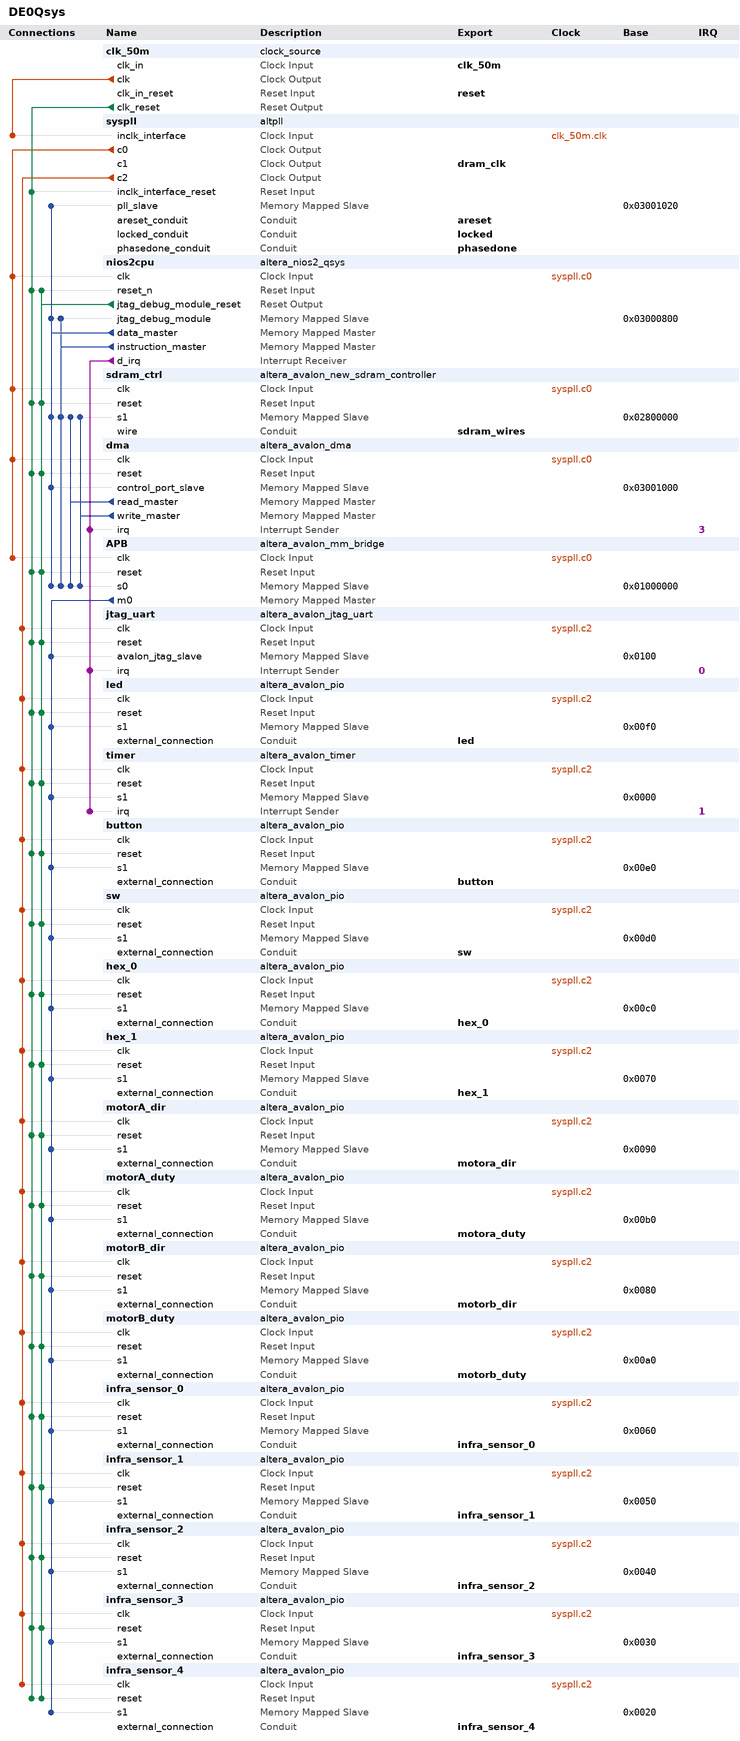
[diagram p0: system contents]
# Platform Designer (Qsys) system DE0Qsys, Cyclone III EP3C16F484C6
# Parameters at their usual value, and those the tool derives, are not listed.
package require -exact qsys 13.0.1.99.2
create_system DE0Qsys
set_project_property DEVICE_FAMILY {Cyclone III}
set_project_property DEVICE EP3C16F484C6

add_instance clk_50m clock_source 13.0
set_instance_parameter_value clk_50m clockFrequency 50000000

add_instance syspll altpll 13.0
set_instance_parameter_value syspll INCLK0_INPUT_FREQUENCY 20000
set_instance_parameter_value syspll CLK0_MULTIPLY_BY 8
set_instance_parameter_value syspll CLK1_MULTIPLY_BY 8
set_instance_parameter_value syspll CLK2_MULTIPLY_BY 1
set_instance_parameter_value syspll CLK0_DIVIDE_BY 3
set_instance_parameter_value syspll CLK1_DIVIDE_BY 3
set_instance_parameter_value syspll CLK2_DIVIDE_BY 5
set_instance_parameter_value syspll CLK1_PHASE_SHIFT -1875
set_instance_parameter_value syspll CLK2_PHASE_SHIFT 0
set_instance_parameter_value syspll CLK1_DUTY_CYCLE 50
set_instance_parameter_value syspll CLK2_DUTY_CYCLE 50
set_instance_parameter_value syspll PORT_clk1 PORT_USED
set_instance_parameter_value syspll PORT_clk2 PORT_USED
set_instance_parameter_value syspll PORT_clk3 PORT_UNUSED
set_instance_parameter_value syspll PORT_ARESET PORT_UNUSED
set_instance_parameter_value syspll PORT_LOCKED PORT_UNUSED

add_instance nios2cpu altera_nios2_qsys 13.0
set_instance_parameter_value nios2cpu resetSlave sdram_ctrl.s1
set_instance_parameter_value nios2cpu mmu_TLBMissExcSlave None
set_instance_parameter_value nios2cpu exceptionSlave sdram_ctrl.s1
set_instance_parameter_value nios2cpu breakSlave nios2cpu.jtag_debug_module
set_instance_parameter_value nios2cpu impl Tiny
set_instance_parameter_value nios2cpu icache_size 4096

add_instance sdram_ctrl altera_avalon_new_sdram_controller 13.0.1.99.2
set_instance_parameter_value sdram_ctrl TAC 5.5
set_instance_parameter_value sdram_ctrl TRCD 20.0
set_instance_parameter_value sdram_ctrl TRP 20.0
set_instance_parameter_value sdram_ctrl casLatency 3
set_instance_parameter_value sdram_ctrl columnWidth 8
set_instance_parameter_value sdram_ctrl dataWidth 16
set_instance_parameter_value sdram_ctrl generateSimulationModel false
set_instance_parameter_value sdram_ctrl model single_Micron_MT48LC4M32B2_7_chip
set_instance_parameter_value sdram_ctrl numberOfBanks 4
set_instance_parameter_value sdram_ctrl numberOfChipSelects 1
set_instance_parameter_value sdram_ctrl powerUpDelay 200.0
set_instance_parameter_value sdram_ctrl refreshPeriod 7.8125
set_instance_parameter_value sdram_ctrl rowWidth 12

add_instance dma altera_avalon_dma 13.0.1.99.2
set_instance_parameter_value dma allowByteTransactions true
set_instance_parameter_value dma allowDoubleWordTransactions true
set_instance_parameter_value dma allowHalfWordTransactions true
set_instance_parameter_value dma allowQuadWordTransactions true
set_instance_parameter_value dma burstEnable true
set_instance_parameter_value dma fifoDepth 32
set_instance_parameter_value dma maxBurstSize 128
set_instance_parameter_value dma minimumDmaTransactionRegisterWidth 13

add_instance APB altera_avalon_mm_bridge 13.0
set_instance_parameter_value APB DATA_WIDTH 32
set_instance_parameter_value APB ADDRESS_WIDTH 10
set_instance_parameter_value APB ADDRESS_UNITS SYMBOLS
set_instance_parameter_value APB MAX_PENDING_RESPONSES 4

add_instance jtag_uart altera_avalon_jtag_uart 13.0.1.99.2
set_instance_parameter_value jtag_uart simInteractiveOptions NO_INTERACTIVE_WINDOWS

add_instance led altera_avalon_pio 13.0.1.99.2
set_instance_parameter_value led direction Output
set_instance_parameter_value led width 10

add_instance timer altera_avalon_timer 13.0.1.99.2
set_instance_parameter_value timer period 1
set_instance_parameter_value timer periodUnits USEC

add_instance button altera_avalon_pio 13.0.1.99.2
set_instance_parameter_value button captureEdge true
set_instance_parameter_value button direction Input
set_instance_parameter_value button edgeType FALLING
set_instance_parameter_value button simDoTestBenchWiring true
set_instance_parameter_value button width 2

add_instance sw altera_avalon_pio 13.0.1.99.2
set_instance_parameter_value sw captureEdge true
set_instance_parameter_value sw direction Input
set_instance_parameter_value sw edgeType ANY
set_instance_parameter_value sw simDoTestBenchWiring true
set_instance_parameter_value sw width 10

add_instance hex_0 altera_avalon_pio 13.0.1.99.2
set_instance_parameter_value hex_0 direction Output
set_instance_parameter_value hex_0 width 8

add_instance hex_1 altera_avalon_pio 13.0.1.99.2
set_instance_parameter_value hex_1 direction Output
set_instance_parameter_value hex_1 width 8

add_instance motorA_dir altera_avalon_pio 13.0.1.99.2
set_instance_parameter_value motorA_dir direction Output
set_instance_parameter_value motorA_dir width 2

add_instance motorA_duty altera_avalon_pio 13.0.1.99.2
set_instance_parameter_value motorA_duty direction Output
set_instance_parameter_value motorA_duty width 8

add_instance motorB_dir altera_avalon_pio 13.0.1.99.2
set_instance_parameter_value motorB_dir direction Output
set_instance_parameter_value motorB_dir width 2

add_instance motorB_duty altera_avalon_pio 13.0.1.99.2
set_instance_parameter_value motorB_duty direction Output
set_instance_parameter_value motorB_duty width 8

add_instance infra_sensor_0 altera_avalon_pio 13.0.1.99.2
set_instance_parameter_value infra_sensor_0 direction Input
set_instance_parameter_value infra_sensor_0 simDoTestBenchWiring true
set_instance_parameter_value infra_sensor_0 width 1

add_instance infra_sensor_1 altera_avalon_pio 13.0.1.99.2
set_instance_parameter_value infra_sensor_1 direction Input
set_instance_parameter_value infra_sensor_1 simDoTestBenchWiring true
set_instance_parameter_value infra_sensor_1 width 1

add_instance infra_sensor_2 altera_avalon_pio 13.0.1.99.2
set_instance_parameter_value infra_sensor_2 direction Input
set_instance_parameter_value infra_sensor_2 simDoTestBenchWiring true
set_instance_parameter_value infra_sensor_2 width 1

add_instance infra_sensor_3 altera_avalon_pio 13.0.1.99.2
set_instance_parameter_value infra_sensor_3 direction Input
set_instance_parameter_value infra_sensor_3 simDoTestBenchWiring true
set_instance_parameter_value infra_sensor_3 width 1

add_instance infra_sensor_4 altera_avalon_pio 13.0.1.99.2
set_instance_parameter_value infra_sensor_4 direction Input
set_instance_parameter_value infra_sensor_4 simDoTestBenchWiring true
set_instance_parameter_value infra_sensor_4 width 1

# connections
add_connection clk_50m.clk syspll.inclk_interface clock
add_connection syspll.c0 APB.clk clock
add_connection syspll.c0 dma.clk clock
add_connection syspll.c0 nios2cpu.clk clock
add_connection syspll.c0 sdram_ctrl.clk clock
add_connection syspll.c2 button.clk clock
add_connection syspll.c2 hex_0.clk clock
add_connection syspll.c2 hex_1.clk clock
add_connection syspll.c2 infra_sensor_0.clk clock
add_connection syspll.c2 infra_sensor_1.clk clock
add_connection syspll.c2 infra_sensor_2.clk clock
add_connection syspll.c2 infra_sensor_3.clk clock
add_connection syspll.c2 infra_sensor_4.clk clock
add_connection syspll.c2 jtag_uart.clk clock
add_connection syspll.c2 led.clk clock
add_connection syspll.c2 motorA_dir.clk clock
add_connection syspll.c2 motorA_duty.clk clock
add_connection syspll.c2 motorB_dir.clk clock
add_connection syspll.c2 motorB_duty.clk clock
add_connection syspll.c2 sw.clk clock
add_connection syspll.c2 timer.clk clock
add_connection clk_50m.clk_reset APB.reset reset
add_connection clk_50m.clk_reset button.reset reset
add_connection clk_50m.clk_reset dma.reset reset
add_connection clk_50m.clk_reset hex_0.reset reset
add_connection clk_50m.clk_reset hex_1.reset reset
add_connection clk_50m.clk_reset infra_sensor_0.reset reset
add_connection clk_50m.clk_reset infra_sensor_1.reset reset
add_connection clk_50m.clk_reset infra_sensor_2.reset reset
add_connection clk_50m.clk_reset infra_sensor_3.reset reset
add_connection clk_50m.clk_reset infra_sensor_4.reset reset
add_connection clk_50m.clk_reset jtag_uart.reset reset
add_connection clk_50m.clk_reset led.reset reset
add_connection clk_50m.clk_reset motorA_dir.reset reset
add_connection clk_50m.clk_reset motorA_duty.reset reset
add_connection clk_50m.clk_reset motorB_dir.reset reset
add_connection clk_50m.clk_reset motorB_duty.reset reset
add_connection clk_50m.clk_reset nios2cpu.reset_n reset
add_connection clk_50m.clk_reset sdram_ctrl.reset reset
add_connection clk_50m.clk_reset sw.reset reset
add_connection clk_50m.clk_reset syspll.inclk_interface_reset reset
add_connection clk_50m.clk_reset timer.reset reset
add_connection nios2cpu.jtag_debug_module_reset APB.reset reset
add_connection nios2cpu.jtag_debug_module_reset button.reset reset
add_connection nios2cpu.jtag_debug_module_reset dma.reset reset
add_connection nios2cpu.jtag_debug_module_reset hex_0.reset reset
add_connection nios2cpu.jtag_debug_module_reset hex_1.reset reset
add_connection nios2cpu.jtag_debug_module_reset infra_sensor_0.reset reset
add_connection nios2cpu.jtag_debug_module_reset infra_sensor_1.reset reset
add_connection nios2cpu.jtag_debug_module_reset infra_sensor_2.reset reset
add_connection nios2cpu.jtag_debug_module_reset infra_sensor_3.reset reset
add_connection nios2cpu.jtag_debug_module_reset infra_sensor_4.reset reset
add_connection nios2cpu.jtag_debug_module_reset jtag_uart.reset reset
add_connection nios2cpu.jtag_debug_module_reset led.reset reset
add_connection nios2cpu.jtag_debug_module_reset motorA_dir.reset reset
add_connection nios2cpu.jtag_debug_module_reset motorA_duty.reset reset
add_connection nios2cpu.jtag_debug_module_reset motorB_dir.reset reset
add_connection nios2cpu.jtag_debug_module_reset motorB_duty.reset reset
add_connection nios2cpu.jtag_debug_module_reset nios2cpu.reset_n reset
add_connection nios2cpu.jtag_debug_module_reset sdram_ctrl.reset reset
add_connection nios2cpu.jtag_debug_module_reset sw.reset reset
add_connection nios2cpu.jtag_debug_module_reset timer.reset reset
add_connection APB.m0 button.s1 avalon
set_connection_parameter_value APB.m0/button.s1 baseAddress 0x00e0
add_connection APB.m0 hex_0.s1 avalon
set_connection_parameter_value APB.m0/hex_0.s1 baseAddress 0x00c0
add_connection APB.m0 hex_1.s1 avalon
set_connection_parameter_value APB.m0/hex_1.s1 baseAddress 0x0070
add_connection APB.m0 infra_sensor_0.s1 avalon
set_connection_parameter_value APB.m0/infra_sensor_0.s1 baseAddress 0x0060
add_connection APB.m0 infra_sensor_1.s1 avalon
set_connection_parameter_value APB.m0/infra_sensor_1.s1 baseAddress 0x0050
add_connection APB.m0 infra_sensor_2.s1 avalon
set_connection_parameter_value APB.m0/infra_sensor_2.s1 baseAddress 0x0040
add_connection APB.m0 infra_sensor_3.s1 avalon
set_connection_parameter_value APB.m0/infra_sensor_3.s1 baseAddress 0x0030
add_connection APB.m0 infra_sensor_4.s1 avalon
set_connection_parameter_value APB.m0/infra_sensor_4.s1 baseAddress 0x0020
add_connection APB.m0 jtag_uart.avalon_jtag_slave avalon
set_connection_parameter_value APB.m0/jtag_uart.avalon_jtag_slave baseAddress 0x0100
add_connection APB.m0 led.s1 avalon
set_connection_parameter_value APB.m0/led.s1 baseAddress 0x00f0
add_connection APB.m0 motorA_dir.s1 avalon
set_connection_parameter_value APB.m0/motorA_dir.s1 baseAddress 0x0090
add_connection APB.m0 motorA_duty.s1 avalon
set_connection_parameter_value APB.m0/motorA_duty.s1 baseAddress 0x00b0
add_connection APB.m0 motorB_dir.s1 avalon
set_connection_parameter_value APB.m0/motorB_dir.s1 baseAddress 0x0080
add_connection APB.m0 motorB_duty.s1 avalon
set_connection_parameter_value APB.m0/motorB_duty.s1 baseAddress 0x00a0
add_connection APB.m0 sw.s1 avalon
set_connection_parameter_value APB.m0/sw.s1 baseAddress 0x00d0
add_connection APB.m0 timer.s1 avalon
set_connection_parameter_value APB.m0/timer.s1 baseAddress 0x0000
add_connection dma.read_master APB.s0 avalon
set_connection_parameter_value dma.read_master/APB.s0 baseAddress 0x01000000
add_connection dma.read_master sdram_ctrl.s1 avalon
set_connection_parameter_value dma.read_master/sdram_ctrl.s1 baseAddress 0x02800000
add_connection dma.write_master APB.s0 avalon
set_connection_parameter_value dma.write_master/APB.s0 baseAddress 0x01000000
add_connection dma.write_master sdram_ctrl.s1 avalon
set_connection_parameter_value dma.write_master/sdram_ctrl.s1 baseAddress 0x02800000
add_connection nios2cpu.data_master APB.s0 avalon
set_connection_parameter_value nios2cpu.data_master/APB.s0 baseAddress 0x01000000
add_connection nios2cpu.data_master dma.control_port_slave avalon
set_connection_parameter_value nios2cpu.data_master/dma.control_port_slave baseAddress 0x03001000
add_connection nios2cpu.data_master nios2cpu.jtag_debug_module avalon
set_connection_parameter_value nios2cpu.data_master/nios2cpu.jtag_debug_module baseAddress 0x03000800
add_connection nios2cpu.data_master sdram_ctrl.s1 avalon
set_connection_parameter_value nios2cpu.data_master/sdram_ctrl.s1 baseAddress 0x02800000
add_connection nios2cpu.data_master syspll.pll_slave avalon
set_connection_parameter_value nios2cpu.data_master/syspll.pll_slave baseAddress 0x03001020
add_connection nios2cpu.instruction_master APB.s0 avalon
set_connection_parameter_value nios2cpu.instruction_master/APB.s0 baseAddress 0x01000000
add_connection nios2cpu.instruction_master nios2cpu.jtag_debug_module avalon
set_connection_parameter_value nios2cpu.instruction_master/nios2cpu.jtag_debug_module baseAddress 0x03000800
add_connection nios2cpu.instruction_master sdram_ctrl.s1 avalon
set_connection_parameter_value nios2cpu.instruction_master/sdram_ctrl.s1 baseAddress 0x02800000
add_connection nios2cpu.d_irq dma.irq interrupt
set_connection_parameter_value nios2cpu.d_irq/dma.irq irqNumber 3
add_connection nios2cpu.d_irq jtag_uart.irq interrupt
set_connection_parameter_value nios2cpu.d_irq/jtag_uart.irq irqNumber 0
add_connection nios2cpu.d_irq timer.irq interrupt
set_connection_parameter_value nios2cpu.d_irq/timer.irq irqNumber 1

# exported interfaces
add_interface clk_50m clock sink
set_interface_property clk_50m EXPORT_OF clk_50m.clk_in
add_interface reset reset sink
set_interface_property reset EXPORT_OF clk_50m.clk_in_reset
add_interface dram_clk clock source
set_interface_property dram_clk EXPORT_OF syspll.c1
add_interface areset conduit end
set_interface_property areset EXPORT_OF syspll.areset_conduit
add_interface locked conduit end
set_interface_property locked EXPORT_OF syspll.locked_conduit
add_interface phasedone conduit end
set_interface_property phasedone EXPORT_OF syspll.phasedone_conduit
add_interface sdram_wires conduit end
set_interface_property sdram_wires EXPORT_OF sdram_ctrl.wire
add_interface led conduit end
set_interface_property led EXPORT_OF led.external_connection
add_interface button conduit end
set_interface_property button EXPORT_OF button.external_connection
add_interface sw conduit end
set_interface_property sw EXPORT_OF sw.external_connection
add_interface hex_0 conduit end
set_interface_property hex_0 EXPORT_OF hex_0.external_connection
add_interface motora_duty conduit end
set_interface_property motora_duty EXPORT_OF motorA_duty.external_connection
add_interface motorb_duty conduit end
set_interface_property motorb_duty EXPORT_OF motorB_duty.external_connection
add_interface motora_dir conduit end
set_interface_property motora_dir EXPORT_OF motorA_dir.external_connection
add_interface motorb_dir conduit end
set_interface_property motorb_dir EXPORT_OF motorB_dir.external_connection
add_interface hex_1 conduit end
set_interface_property hex_1 EXPORT_OF hex_1.external_connection
add_interface infra_sensor_0 conduit end
set_interface_property infra_sensor_0 EXPORT_OF infra_sensor_0.external_connection
add_interface infra_sensor_4 conduit end
set_interface_property infra_sensor_4 EXPORT_OF infra_sensor_4.external_connection
add_interface infra_sensor_3 conduit end
set_interface_property infra_sensor_3 EXPORT_OF infra_sensor_3.external_connection
add_interface infra_sensor_2 conduit end
set_interface_property infra_sensor_2 EXPORT_OF infra_sensor_2.external_connection
add_interface infra_sensor_1 conduit end
set_interface_property infra_sensor_1 EXPORT_OF infra_sensor_1.external_connection

set_interconnect_requirement {$system} qsys_mm.clockCrossingAdapter HANDSHAKE
set_interconnect_requirement {$system} qsys_mm.maxAdditionalLatency 1

save_system DE0Qsys.qsys
